# Altium project PCB_Project.PrjPcb
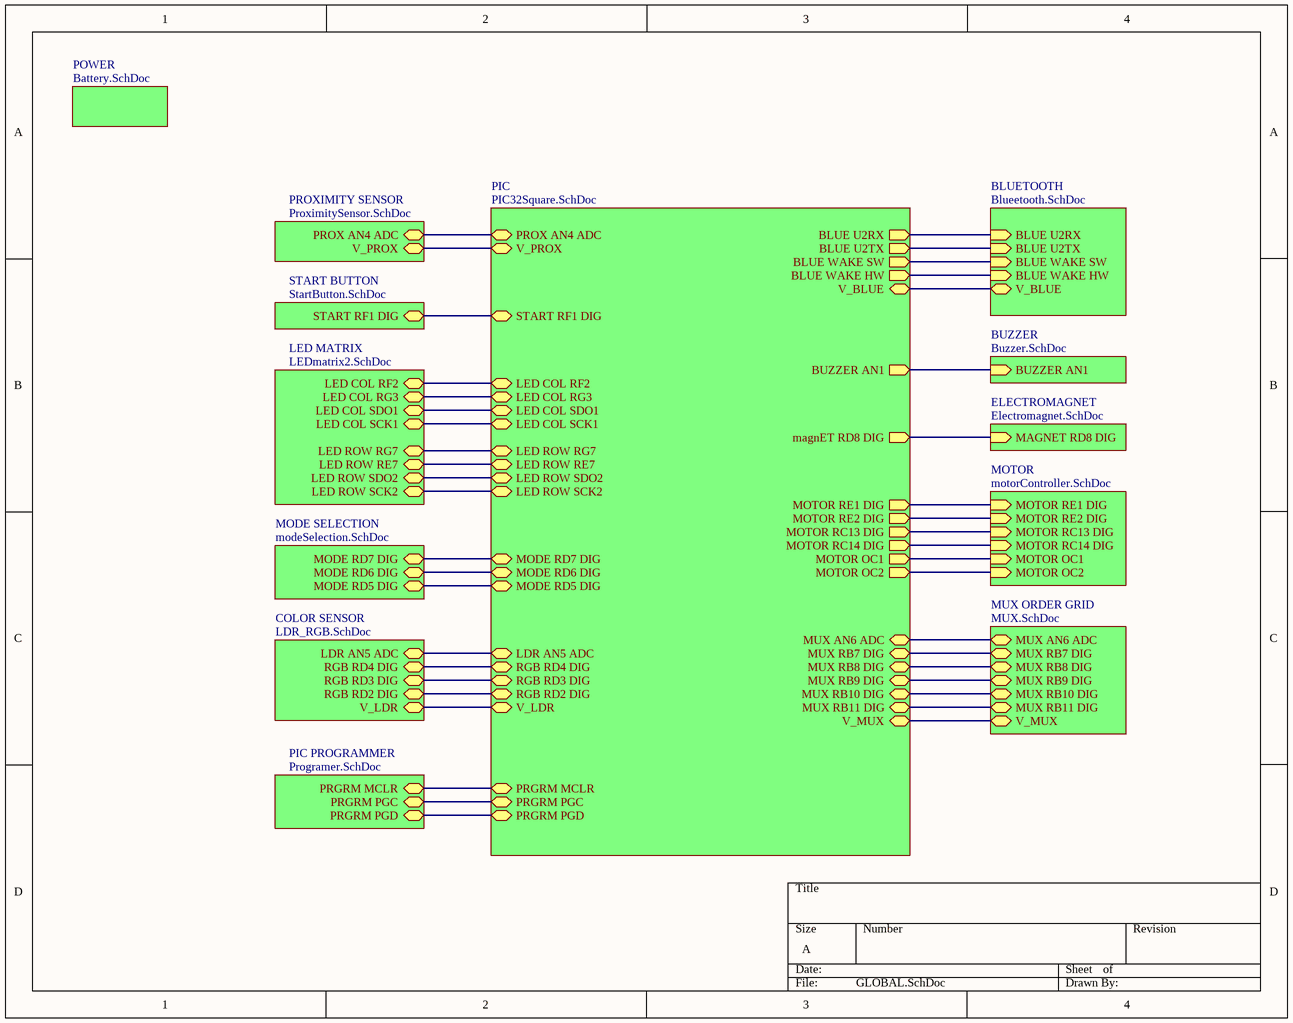
[diagram p0: GLOBAL.SchDoc]
14 sheets, 109 parts. Net scope: hierarchical (ports join the sheet entries above them; power ports are global).
Board file: PCB2.PcbDoc
Sheets:
  GLOBAL.SchDoc
    PIC = PIC32Square.SchDoc
    BLUETOOTH = Blueetooth.SchDoc
    BUZZER = Buzzer.SchDoc
    ELECTROMAGNET = Electromagnet.SchDoc
    MOTOR = motorController.SchDoc
    PROXIMITY SENSOR = ProximitySensor.SchDoc
    START BUTTON = StartButton.SchDoc
    LED MATRIX = LEDmatrix2.SchDoc
    MODE SELECTION = modeSelection.SchDoc
    COLOR SENSOR = LDR_RGB.SchDoc
    MUX ORDER GRID = MUX.SchDoc
    POWER = Battery.SchDoc
    PIC PROGRAMMER = Programer.SchDoc

## Sheet GLOBAL.SchDoc
size A

### Sub-sheets
BLUETOOTH = Blueetooth.SchDoc: BLUE U2RX (in), BLUE U2TX (in), BLUE WAKE SW (in), BLUE WAKE HW (in), V_BLUE
BUZZER = Buzzer.SchDoc: BUZZER AN1 (in)
COLOR SENSOR = LDR_RGB.SchDoc: LDR AN5 ADC, RGB RD4 DIG, RGB RD3 DIG, RGB RD2 DIG, V_LDR
ELECTROMAGNET = Electromagnet.SchDoc: MAGNET RD8 DIG (in)
LED MATRIX = LEDmatrix2.SchDoc: LED COL RF2, LED COL RG3, LED COL SDO1, LED COL SCK1, LED ROW RG7, LED ROW RE7, LED ROW SDO2, LED ROW SCK2
MODE SELECTION = modeSelection.SchDoc: MODE RD7 DIG, MODE RD6 DIG, MODE RD5 DIG
MOTOR = motorController.SchDoc: MOTOR RE1 DIG (in), MOTOR RE2 DIG (in), MOTOR RC13 DIG (in), MOTOR RC14 DIG (in), MOTOR OC1 (in), MOTOR OC2 (in)
MUX ORDER GRID = MUX.SchDoc: MUX AN6 ADC, MUX RB7 DIG, MUX RB8 DIG, MUX RB9 DIG, MUX RB10 DIG, MUX RB11 DIG, V_MUX
PIC = PIC32Square.SchDoc: BLUE U2RX (out), BLUE U2TX (out), BLUE WAKE SW (out), BLUE WAKE HW (out), BUZZER AN1 (out), magnET RD8 DIG (out), MOTOR RE1 DIG (out), MOTOR RE2 DIG (out), MOTOR RC13 DIG (out), MOTOR RC14 DIG (out), MOTOR OC1 (out), MOTOR OC2 (out), PROX AN4 ADC, START RF1 DIG, LED COL RF2, LED COL RG3, LED COL SDO1, LED COL SCK1, LED ROW RG7, LED ROW RE7, LED ROW SDO2, LED ROW SCK2, MODE RD7 DIG, MODE RD6 DIG, MODE RD5 DIG, LDR AN5 ADC, RGB RD4 DIG, RGB RD3 DIG, RGB RD2 DIG, MUX AN6 ADC, MUX RB7 DIG, MUX RB8 DIG, MUX RB9 DIG, MUX RB10 DIG, MUX RB11 DIG, V_BLUE, V_MUX, V_PROX, V_LDR, PRGRM MCLR, PRGRM PGD, PRGRM PGC
PIC PROGRAMMER = Programer.SchDoc: PRGRM MCLR, PRGRM PGC, PRGRM PGD
POWER = Battery.SchDoc: no entries
PROXIMITY SENSOR = ProximitySensor.SchDoc: PROX AN4 ADC, V_PROX
START BUTTON = StartButton.SchDoc: START RF1 DIG

### Nets
NetC3_2: sheet PIC/V_BLUE, sheet BLUETOOTH/V_BLUE
NetC5_1: sheet PIC/PRGRM MCLR, sheet PIC PROGRAMMER/PRGRM MCLR
NetP1_1: sheet PIC/V_LDR, sheet COLOR SENSOR/V_LDR
NetP1_2: sheet PIC/LDR AN5 ADC, sheet COLOR SENSOR/LDR AN5 ADC
NetPIC32Square_1: sheet PIC/magnET RD8 DIG, sheet ELECTROMAGNET/MAGNET RD8 DIG
NetPIC32Square_2: sheet PIC/RGB RD2 DIG, sheet COLOR SENSOR/RGB RD2 DIG
NetPIC32Square_3: sheet PIC/RGB RD3 DIG, sheet COLOR SENSOR/RGB RD3 DIG
NetPIC32Square_4: sheet PIC/RGB RD4 DIG, sheet COLOR SENSOR/RGB RD4 DIG
NetPIC32Square_6: sheet PIC/V_PROX, sheet PROXIMITY SENSOR/V_PROX
NetPIC32Square_12: sheet PIC/PROX AN4 ADC, sheet PROXIMITY SENSOR/PROX AN4 ADC
NetPIC32Square_13: sheet PIC/MUX AN6 ADC, sheet MUX ORDER GRID/MUX AN6 ADC
NetPIC32Square_15: sheet PIC/PRGRM PGC, sheet PIC PROGRAMMER/PRGRM PGC
NetPIC32Square_16: sheet PIC/PRGRM PGD, sheet PIC PROGRAMMER/PRGRM PGD
NetPIC32Square_17: sheet PIC/V_MUX, sheet MUX ORDER GRID/V_MUX
NetPIC32Square_18: sheet PIC/MUX RB11 DIG, sheet MUX ORDER GRID/MUX RB11 DIG
NetPIC32Square_21: sheet PIC/MUX RB10 DIG, sheet MUX ORDER GRID/MUX RB10 DIG
NetPIC32Square_22: sheet PIC/MUX RB9 DIG, sheet MUX ORDER GRID/MUX RB9 DIG
NetPIC32Square_23: sheet PIC/MUX RB8 DIG, sheet MUX ORDER GRID/MUX RB8 DIG
NetPIC32Square_24: sheet PIC/MUX RB7 DIG, sheet MUX ORDER GRID/MUX RB7 DIG
NetPIC32Square_27: sheet PIC/BUZZER AN1, sheet BUZZER/BUZZER AN1
NetPIC32Square_29: sheet PIC/BLUE WAKE HW, sheet BLUETOOTH/BLUE WAKE HW
NetPIC32Square_30: sheet PIC/BLUE WAKE SW, sheet BLUETOOTH/BLUE WAKE SW
NetPIC32Square_31: sheet PIC/BLUE U2RX, sheet BLUETOOTH/BLUE U2RX
NetPIC32Square_32: sheet PIC/BLUE U2TX, sheet BLUETOOTH/BLUE U2TX
NetPIC32Square_33: sheet PIC/MODE RD6 DIG, sheet MODE SELECTION/MODE RD6 DIG
NetPIC32Square_34: sheet PIC/MODE RD5 DIG, sheet MODE SELECTION/MODE RD5 DIG
NetPIC32Square_35: sheet PIC/MODE RD7 DIG, sheet MODE SELECTION/MODE RD7 DIG
NetPIC32Square_36: sheet PIC/START RF1 DIG, sheet START BUTTON/START RF1 DIG
NetPIC32Square_49: sheet PIC/MOTOR RC13 DIG, sheet MOTOR/MOTOR RC13 DIG
NetPIC32Square_50: sheet PIC/MOTOR OC2, sheet MOTOR/MOTOR OC2
NetPIC32Square_51: sheet PIC/MOTOR RC14 DIG, sheet MOTOR/MOTOR RC14 DIG
NetPIC32Square_52: sheet PIC/MOTOR OC1, sheet MOTOR/MOTOR OC1
NetPIC32Square_53: sheet PIC/MOTOR RE1 DIG, sheet MOTOR/MOTOR RE1 DIG
NetPIC32Square_54: sheet PIC/MOTOR RE2 DIG, sheet MOTOR/MOTOR RE2 DIG
NetPIC32Square_55: sheet PIC/LED ROW RE7, sheet LED MATRIX/LED ROW RE7
NetPIC32Square_58: sheet PIC/LED ROW SCK2, sheet LED MATRIX/LED ROW SCK2
NetPIC32Square_59: sheet PIC/LED COL RF2, sheet LED MATRIX/LED COL RF2
NetPIC32Square_60: sheet PIC/LED COL SDO1, sheet LED MATRIX/LED COL SDO1
NetPIC32Square_61: sheet PIC/LED ROW SDO2, sheet LED MATRIX/LED ROW SDO2
NetPIC32Square_62: sheet PIC/LED ROW RG7, sheet LED MATRIX/LED ROW RG7
NetPIC32Square_63: sheet PIC/LED COL RG3, sheet LED MATRIX/LED COL RG3
NetPIC32Square_64: sheet PIC/LED COL SCK1, sheet LED MATRIX/LED COL SCK1

## Sheet PIC32Square.SchDoc
size A
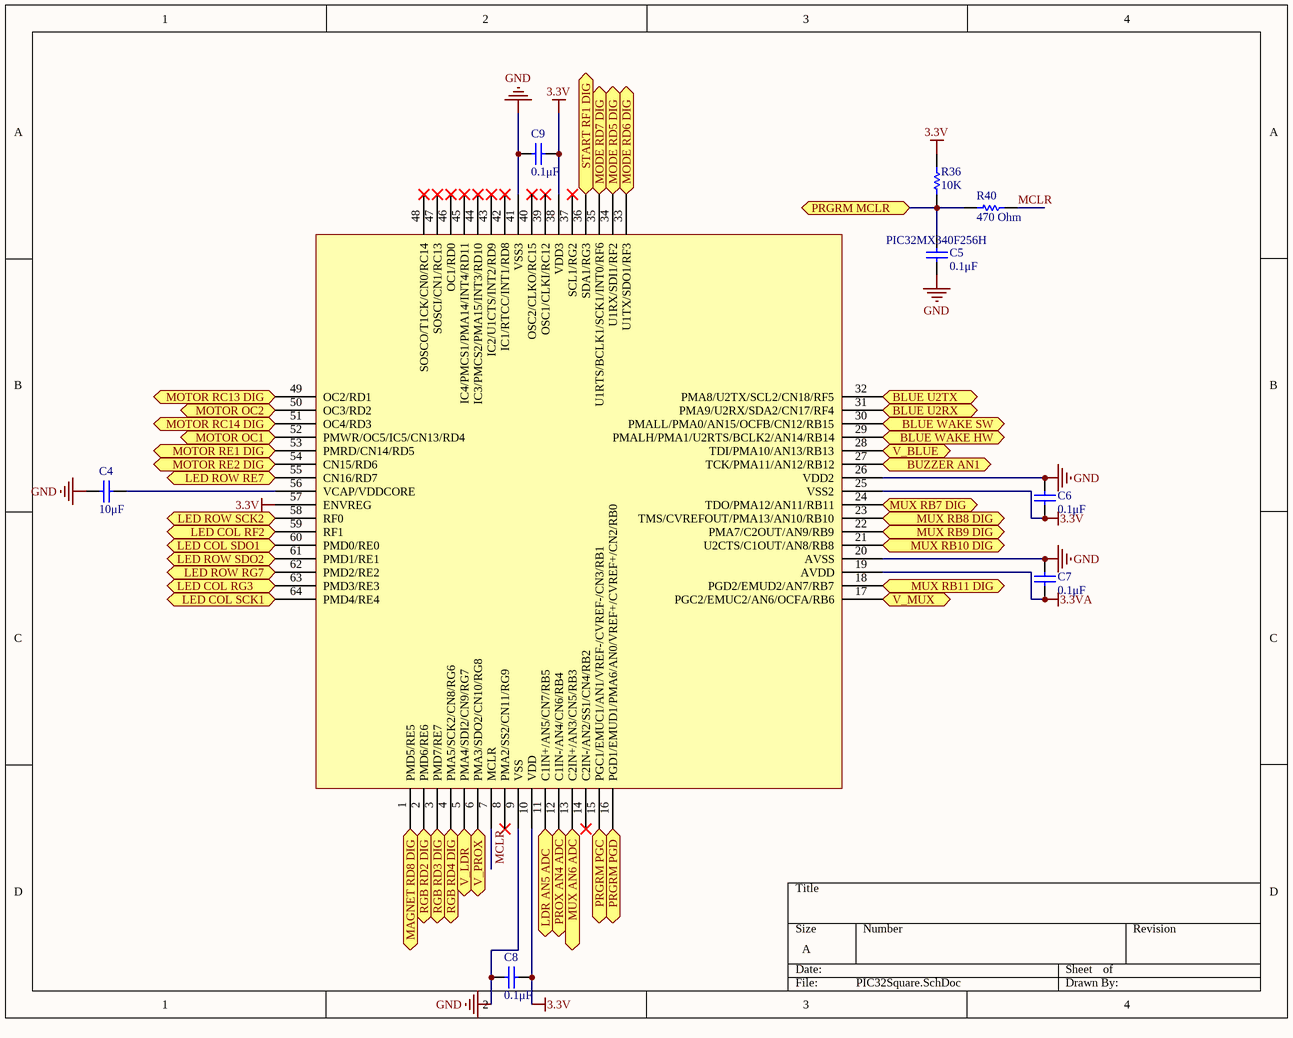
[diagram p1: PIC32Square.SchDoc]

### Parts
C4  10μF  [Capacitor]
C5  0.1μF  [Capacitor]
C6  0.1μF  [Capacitor]
C7  0.1μF  [Capacitor]
C8  0.1μF  [Capacitor]
C9  0.1μF  [Capacitor]
PIC32Square  PIC32MX340F256H  [PIC32]
R36  10K  [Resistor0603]
R40  470 Ohm  [Resistor0603]

### Ports
BLUE U2RX, BLUE U2TX, BLUE WAKE HW, BLUE WAKE SW, BUZZER AN1, LDR AN5 ADC, LED COL RF2, LED COL RG3, LED COL SCK1, LED COL SDO1, LED ROW RE7, LED ROW RG7, LED ROW SCK2, LED ROW SDO2, MAGNET RD8 DIG, MODE RD5 DIG, MODE RD6 DIG, MODE RD7 DIG, MOTOR OC1, MOTOR OC2, MOTOR RC13 DIG, MOTOR RC14 DIG, MOTOR RE1 DIG, MOTOR RE2 DIG, MUX AN6 ADC, MUX RB7 DIG, MUX RB8 DIG, MUX RB9 DIG, MUX RB10 DIG, MUX RB11 DIG, PRGRM MCLR, PRGRM PGC, PRGRM PGD, PROX AN4 ADC, RGB RD2 DIG, RGB RD3 DIG, RGB RD4 DIG, START RF1 DIG, V_BLUE, V_LDR, V_MUX, V_PROX

### Nets
3.3V: C6.1 C8.1 C9.2 PIC32Square.10(VDD) PIC32Square.25(VSS2) PIC32Square.38(VDD3) PIC32Square.57(ENVREG) R36.2
3.3VA: C7.1 PIC32Square.19(AVDD)
GND: C4.2 C5.2 C6.2 C7.2 C8.2 C9.1 PIC32Square.9(VSS) PIC32Square.20(AVSS) PIC32Square.26(VDD2) PIC32Square.41(VSS3)
MCLR: PIC32Square.7(MCLR) R40.1
NetC3_2: PIC32Square.28(TDI/PMA10/AN13/RB13) ; port V_BLUE
NetC4_1: C4.1 PIC32Square.56(VCAP/VDDCORE)
NetC5_1: C5.1 R36.1 R40.2 ; port PRGRM MCLR
NetP1_1: PIC32Square.5(PMA4/SDI2/CN9/RG7) ; port V_LDR
NetP1_2: PIC32Square.11(C1IN+/AN5/CN7/RB5) ; port LDR AN5 ADC
NetPIC32Square_1: PIC32Square.1(PMD5/RE5) ; port MAGNET RD8 DIG
NetPIC32Square_2: PIC32Square.2(PMD6/RE6) ; port RGB RD2 DIG
NetPIC32Square_3: PIC32Square.3(PMD7/RE7) ; port RGB RD3 DIG
NetPIC32Square_4: PIC32Square.4(PMA5/SCK2/CN8/RG6) ; port RGB RD4 DIG
NetPIC32Square_6: PIC32Square.6(PMA3/SDO2/CN10/RG8) ; port V_PROX
NetPIC32Square_12: PIC32Square.12(C1IN-/AN4/CN6/RB4) ; port PROX AN4 ADC
NetPIC32Square_13: PIC32Square.13(C2IN+/AN3/CN5/RB3) ; port MUX AN6 ADC
NetPIC32Square_15: PIC32Square.15(PGC1/EMUC1/AN1/VREF-/CVREF-/CN3/RB1) ; port PRGRM PGC
NetPIC32Square_16: PIC32Square.16(PGD1/EMUD1/PMA6/AN0/VREF+/CVREF+/CN2/RB0) ; port PRGRM PGD
NetPIC32Square_17: PIC32Square.17(PGC2/EMUC2/AN6/OCFA/RB6) ; port V_MUX
NetPIC32Square_18: PIC32Square.18(PGD2/EMUD2/AN7/RB7) ; port MUX RB11 DIG
NetPIC32Square_21: PIC32Square.21(U2CTS/C1OUT/AN8/RB8) ; port MUX RB10 DIG
NetPIC32Square_22: PIC32Square.22(PMA7/C2OUT/AN9/RB9) ; port MUX RB9 DIG
NetPIC32Square_23: PIC32Square.23(TMS/CVREFOUT/PMA13/AN10/RB10) ; port MUX RB8 DIG
NetPIC32Square_24: PIC32Square.24(TDO/PMA12/AN11/RB11) ; port MUX RB7 DIG
NetPIC32Square_27: PIC32Square.27(TCK/PMA11/AN12/RB12) ; port BUZZER AN1
NetPIC32Square_29: PIC32Square.29(PMALH/PMA1/U2RTS/BCLK2/AN14/RB14) ; port BLUE WAKE HW
NetPIC32Square_30: PIC32Square.30(PMALL/PMA0/AN15/OCFB/CN12/RB15) ; port BLUE WAKE SW
NetPIC32Square_31: PIC32Square.31(PMA9/U2RX/SDA2/CN17/RF4) ; port BLUE U2RX
NetPIC32Square_32: PIC32Square.32(PMA8/U2TX/SCL2/CN18/RF5) ; port BLUE U2TX
NetPIC32Square_33: PIC32Square.33(U1TX/SDO1/RF3) ; port MODE RD6 DIG
NetPIC32Square_34: PIC32Square.34(U1RX/SDI1/RF2) ; port MODE RD5 DIG
NetPIC32Square_35: PIC32Square.35(U1RTS/BCLK1/SCK1/INT0/RF6) ; port MODE RD7 DIG
NetPIC32Square_36: PIC32Square.36(SDA1/RG3) ; port START RF1 DIG
NetPIC32Square_49: PIC32Square.49(OC2/RD1) ; port MOTOR RC13 DIG
NetPIC32Square_50: PIC32Square.50(OC3/RD2) ; port MOTOR OC2
NetPIC32Square_51: PIC32Square.51(OC4/RD3) ; port MOTOR RC14 DIG
NetPIC32Square_52: PIC32Square.52(PMWR/OC5/IC5/CN13/RD4) ; port MOTOR OC1
NetPIC32Square_53: PIC32Square.53(PMRD/CN14/RD5) ; port MOTOR RE1 DIG
NetPIC32Square_54: PIC32Square.54(CN15/RD6) ; port MOTOR RE2 DIG
NetPIC32Square_55: PIC32Square.55(CN16/RD7) ; port LED ROW RE7
NetPIC32Square_58: PIC32Square.58(RF0) ; port LED ROW SCK2
NetPIC32Square_59: PIC32Square.59(RF1) ; port LED COL RF2
NetPIC32Square_60: PIC32Square.60(PMD0/RE0) ; port LED COL SDO1
NetPIC32Square_61: PIC32Square.61(PMD1/RE1) ; port LED ROW SDO2
NetPIC32Square_62: PIC32Square.62(PMD2/RE2) ; port LED ROW RG7
NetPIC32Square_63: PIC32Square.63(PMD3/RE3) ; port LED COL RG3
NetPIC32Square_64: PIC32Square.64(PMD4/RE4) ; port LED COL SCK1

Not connected (* = marked no-connect by the designer): PIC32Square 8(PMA2/SS2/CN11/RG9)* 14(C2IN-/AN2/SS1/CN4/RB2)* 37(SCL1/RG2)* 39(OSC1/CLKI/RC12)* 40(OSC2/CLKO/RC15)* 42(IC1/RTCC/INT1/RD8)* 43(IC2/U1CTS/INT2/RD9)* 44(IC3/PMCS2/PMA15/INT3/RD10)* 45(IC4/PMCS1/PMA14/INT4/RD11)* 46(OC1/RD0)* 47(SOSCI/CN1/RC13)* 48(SOSCO/T1CK/CN0/RC14)*

### Library data of the parts
C4-C9 = Cap: Capacitor; Published: 8-Jun-2000; LatestRevisionDate: 17-Jul-2002; LatestRevisionNote: Re-released for DXP Platform.; PackageReference: RAD-0.3; Publisher: Altium Limited; PackageDescription: Radial Cap, Thru-Hole; 2 Leads; 0.3 in Pin Spacing
  C4: Value: 10μF
  C5-C9: Value: 0.1μF
PIC32Square = PIC32square: Farnell Reference: 1523322
R36 R40 = Res1: Resistor; Published: 8-Jun-2000; LatestRevisionDate: 17-Jul-2002; LatestRevisionNote: Re-released for DXP Platform.; PackageReference: AXIAL-0.3; Publisher: Altium Limited; PackageDescription: Axial Device, Thru-Hole; 2 Leads; 0.3 in Pin Spacing
  R36: Value: 10K
  R40: Value: 470 Ohm

## Sheet Blueetooth.SchDoc
size A
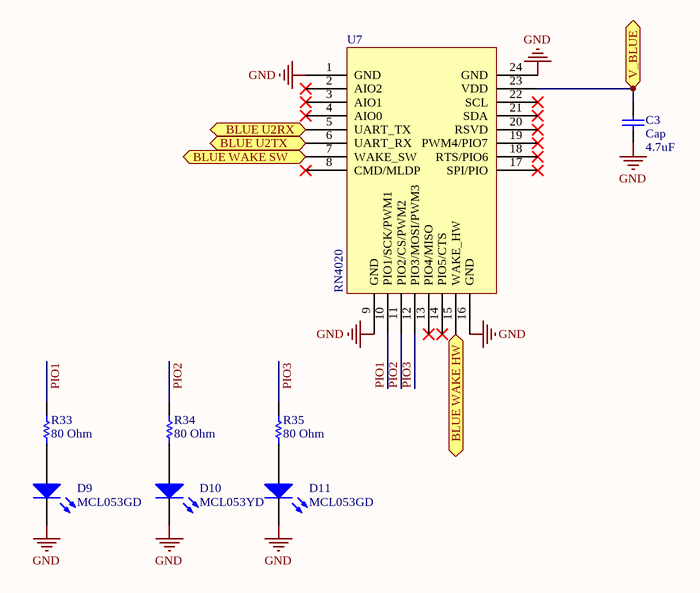
[diagram p2: Blueetooth.SchDoc]

### Parts
C3  Cap  value 4.7uF  [Capacitor]
D9  MCL053GD  [LedGreen]
D10  MCL053YD  [LedGreen]
D11  MCL053GD  [LedGreen]
R33  80 Ohm  [Resistor0603]
R34  80 Ohm  [Resistor0603]
R35  80 Ohm  [Resistor0603]
U7  RN4020  [bluetooth]

### Ports
BLUE U2RX, BLUE U2TX, BLUE WAKE HW, BLUE WAKE SW, V_BLUE

### Nets
GND: C3.1 D9.2(K) D10.2(K) D11.2(K) U7.1(GND) U7.9(GND) U7.16(GND) U7.24(GND)
PIO1: R33.2 U7.10(PIO1/SCK/PWM1)
PIO2: R34.2 U7.11(PIO2/CS/PWM2)
PIO3: R35.2 U7.12(PIO3/MOSI/PWM3)
NetC3_2: C3.2 U7.23(VDD) ; port V_BLUE
NetD9_1: D9.1(A) R33.1
NetD10_1: D10.1(A) R34.1
NetD11_1: D11.1(A) R35.1
NetPIC32Square_29: U7.15(WAKE_HW) ; port BLUE WAKE HW
NetPIC32Square_30: U7.7(WAKE_SW) ; port BLUE WAKE SW
NetPIC32Square_31: U7.5(UART_TX) ; port BLUE U2RX
NetPIC32Square_32: U7.6(UART_RX) ; port BLUE U2TX

Not connected (* = marked no-connect by the designer): U7 2(AIO2)* 3(AIO1)* 4(AIO0)* 8(CMD/MLDP)* 13(PIO4/MISO)* 14(PIO5/CTS)* 17(SPI/PIO)* 18(RTS/PIO6)* 19(PWM4/PIO7)* 20(RSVD)* 21(SDA)* 22(SCL)*

### Library data of the parts
C3 = Cap: Capacitor; Published: 8-Jun-2000; LatestRevisionDate: 17-Jul-2002; LatestRevisionNote: Re-released for DXP Platform.; PackageReference: RAD-0.3; Publisher: Altium Limited; PackageDescription: Radial Cap, Thru-Hole; 2 Leads; 0.3 in Pin Spacing
D9-D11 = LED0: Typical INFRARED GaAs LED; Published: 8-Jun-2000; LatestRevisionDate: 08-Jul-2005; LatestRevisionNote: Mech Layer 1 removed.; PackageReference: LED-0; Publisher: Altium Limited; PackageDescription: LED; 2 Leads
  D9 D11: Farnell Reference: 1581138
  D10: Farnell Reference: 1581139
R33-R35 = Res1: Resistor; Published: 8-Jun-2000; LatestRevisionDate: 17-Jul-2002; LatestRevisionNote: Re-released for DXP Platform.; PackageReference: AXIAL-0.3; Publisher: Altium Limited; PackageDescription: Axial Device, Thru-Hole; 2 Leads; 0.3 in Pin Spacing; Value: 80 Ohm
U7 = Blueetooth: Farnell Reference: 2442930

## Sheet Buzzer.SchDoc
size A
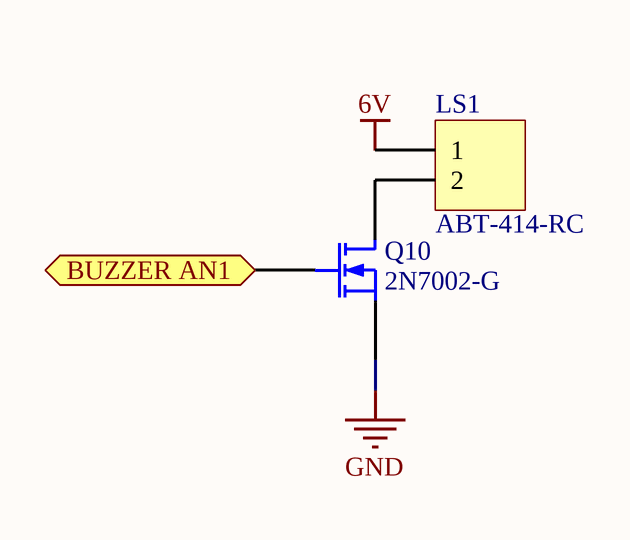
[diagram p3: Buzzer.SchDoc]

### Parts
LS1  ABT-414-RC  [Buzzer]
Q10  2N7002-G  [Mosfet]

### Ports
BUZZER AN1

### Nets
6V: LS1.1
GND: Q10.2(S)
NetLS1_2: LS1.2 Q10.3(D)
NetPIC32Square_27: Q10.1(G) ; port BUZZER AN1

### Library data of the parts
LS1 = Header 2: Header, 2-Pin; LatestRevisionDate: 17-Jul-2002; LatestRevisionNote: Re-released for DXP Platform.; Publisher: Altium Limited
Q10 = MOSFET-N: N-Channel MOSFET; Published: 8-Jun-2000; LatestRevisionDate: 17-Jul-2002; LatestRevisionNote: Re-released for DXP Platform.; PackageVersion: 1995/1996; PackageReference: E3; Publisher: Altium Limited; PackageDescription: TO, Flat Index; 3 In-Line, Axial Leads; Body Dia. 4.6mm; Lead Dia. 0.5 mm (max); Farnell Reference: 2775064

## Sheet Electromagnet.SchDoc
size A
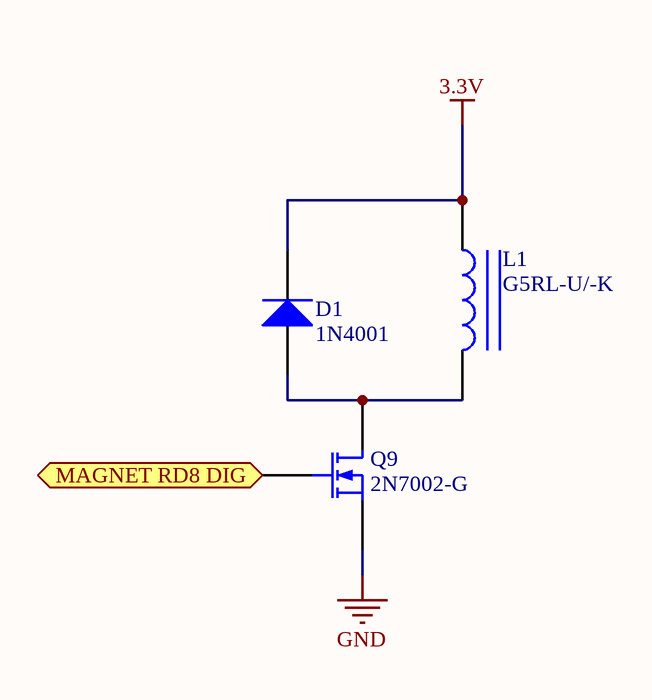
[diagram p4: Electromagnet.SchDoc]

### Parts
D1  1N4001  [Diode]
L1  G5RL-U/-K  [Electromagnet]
Q9  2N7002-G  [Mosfet]

### Ports
MAGNET RD8 DIG

### Nets
3.3V: D1.2(K) L1.1
GND: Q9.2(S)
NetD1_1: D1.1(A) L1.2 Q9.3(D)
NetPIC32Square_1: Q9.1(G) ; port MAGNET RD8 DIG

### Library data of the parts
D1 = Diode: Default Diode; Published: 8-Jun-2000; LatestRevisionDate: 17-Jul-2002; LatestRevisionNote: Re-released for DXP Platform.; PackageVersion: Sep-1996; PackageReference: SMC; Publisher: Altium Limited; PackageDescription: DO-214-AB/SMC; 2 C-Bend Leads; Body 7.9 x 5.9 mm, inc. leads (LxW); Code_JEDEC: DO-214-AB; Farnell Reference: 9564993
L1 = Inductor Iron: Magnetic-Core Inductor; Value: 10mH; Published: 24-Mar-1999; LatestRevisionDate: 17-Jul-2002; LatestRevisionNote: Re-released for DXP Platform.; PackageReference: AXIAL-0.9; Publisher: Altium Limited; PackageDescription: Axial Device, Thru-Hole; 2 Leads; 0.9 in Pin Spacing; Farnell Reference: 2432865
Q9 = MOSFET-N: N-Channel MOSFET; Published: 8-Jun-2000; LatestRevisionDate: 17-Jul-2002; LatestRevisionNote: Re-released for DXP Platform.; PackageVersion: 1995/1996; PackageReference: E3; Publisher: Altium Limited; PackageDescription: TO, Flat Index; 3 In-Line, Axial Leads; Body Dia. 4.6mm; Lead Dia. 0.5 mm (max); Farnell Reference: 2775064

## Sheet motorController.SchDoc
size A
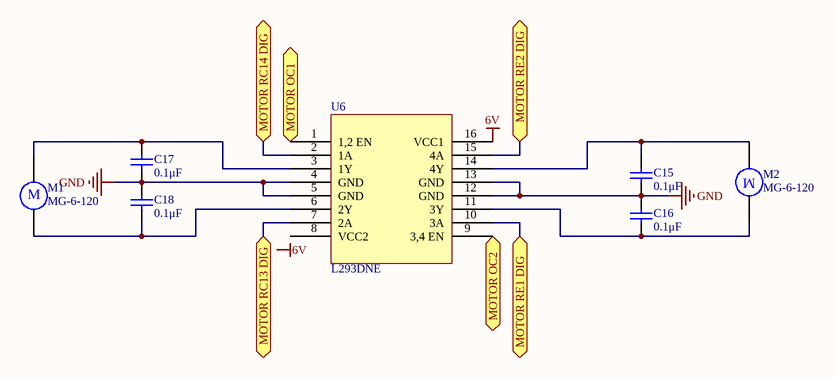
[diagram p5: motorController.SchDoc]

### Parts
C15  0.1μF  [capacitor]
C16  0.1μF  [capacitor]
C17  0.1μF  [capacitor]
C18  0.1μF  [capacitor]
M1  MG-6-120  [Motor2]
M2  MG-6-120  [Motor2]
U6  L293DNE  [MotorDriver]

### Ports
MOTOR OC1, MOTOR OC2, MOTOR RC13 DIG, MOTOR RC14 DIG, MOTOR RE1 DIG, MOTOR RE2 DIG

### Nets
6V: U6.16(VCC1)
GND: C15.2 C16.1 C17.1 C18.2 U6.4(GND) U6.5(GND) U6.12(GND) U6.13(GND)
NetC15_1: C15.1 M2.2 U6.14(4Y)
NetC16_2: C16.2 M2.1 U6.11(3Y)
NetC17_2: C17.2 M1.1 U6.3(1Y)
NetC18_1: C18.1 M1.2 U6.6(2Y)
NetPIC32Square_49: U6.7(2A) ; port MOTOR RC13 DIG
NetPIC32Square_50: U6.9(3,4_EN) ; port MOTOR OC2
NetPIC32Square_51: U6.2(1A) ; port MOTOR RC14 DIG
NetPIC32Square_52: U6.1(1,2_EN) ; port MOTOR OC1
NetPIC32Square_53: U6.10(3A) ; port MOTOR RE1 DIG
NetPIC32Square_54: U6.15(4A) ; port MOTOR RE2 DIG

Not connected (* = marked no-connect by the designer): U6 8(VCC2)

### Notes on the sheet
- Labels drawn without touching a wire or pin: 6V
- (in symbol Motor) M

### Library data of the parts
C15-C18 = Cap: Capacitor; Published: 8-Jun-2000; LatestRevisionDate: 17-Jul-2002; LatestRevisionNote: Re-released for DXP Platform.; PackageReference: RAD-0.3; Publisher: Altium Limited; PackageDescription: Radial Cap, Thru-Hole; 2 Leads; 0.3 in Pin Spacing; Value: 0.1μF
M1 M2 = Motor: Motor, General Kind; Published: 24-Mar-1999; LatestRevisionDate: 17-Jul-2002; LatestRevisionNote: Re-released for DXP Platform.; PackageReference: RB5-10.5; Publisher: Altium Limited; PackageDescription: Capacitor (Radial); 2 Leads; Olimex Reference: MG-6-120
U6 = Motor Driver: Farnell Reference: 1470423

## Sheet ProximitySensor.SchDoc
size A
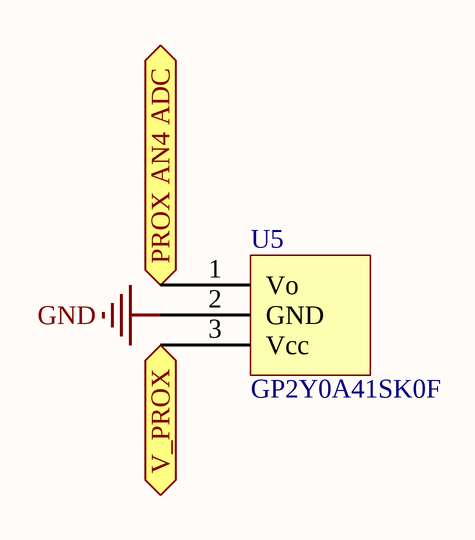
[diagram p6: ProximitySensor.SchDoc]

### Parts
U5  GP2Y0A41SK0F  [Proximity2]

### Ports
PROX AN4 ADC, V_PROX

### Nets
GND: U5.2(GND)
NetPIC32Square_6: U5.3(Vcc) ; port V_PROX
NetPIC32Square_12: U5.1(Vo) ; port PROX AN4 ADC

### Library data of the parts
U5 = Proximity sensor: Farnell Reference: 1618431

## Sheet StartButton.SchDoc
size A
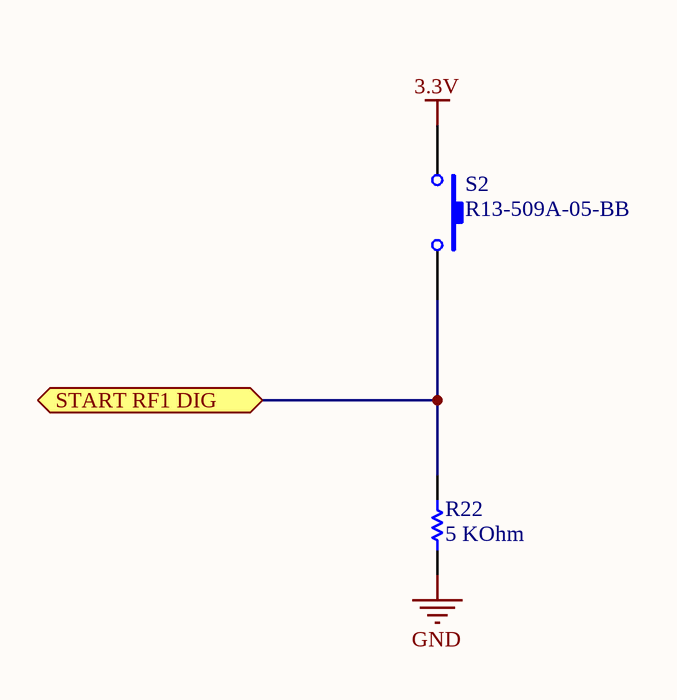
[diagram p7: StartButton.SchDoc]

### Parts
R22  5 KOhm  [Resistor0603]
S2  R13-509A-05-BB  [StartButton]

### Ports
START RF1 DIG

### Nets
3.3V: S2.1
GND: R22.1
NetPIC32Square_36: R22.2 S2.2 ; port START RF1 DIG

### Library data of the parts
R22 = Res1: Resistor; Published: 8-Jun-2000; LatestRevisionDate: 17-Jul-2002; LatestRevisionNote: Re-released for DXP Platform.; PackageReference: AXIAL-0.3; Publisher: Altium Limited; PackageDescription: Axial Device, Thru-Hole; 2 Leads; 0.3 in Pin Spacing; Value: 5 KOhm
S2 = SW-PB: Switch; Published: 24-Mar-1999; LatestRevisionDate: 17-Jul-2002; LatestRevisionNote: Re-released for DXP Platform.; PackageReference: SPST-2; Publisher: Altium Limited; PackageDescription: Switch; 2 Leads; Farnell Reference: 1634682

## Sheet LEDmatrix2.SchDoc
size A
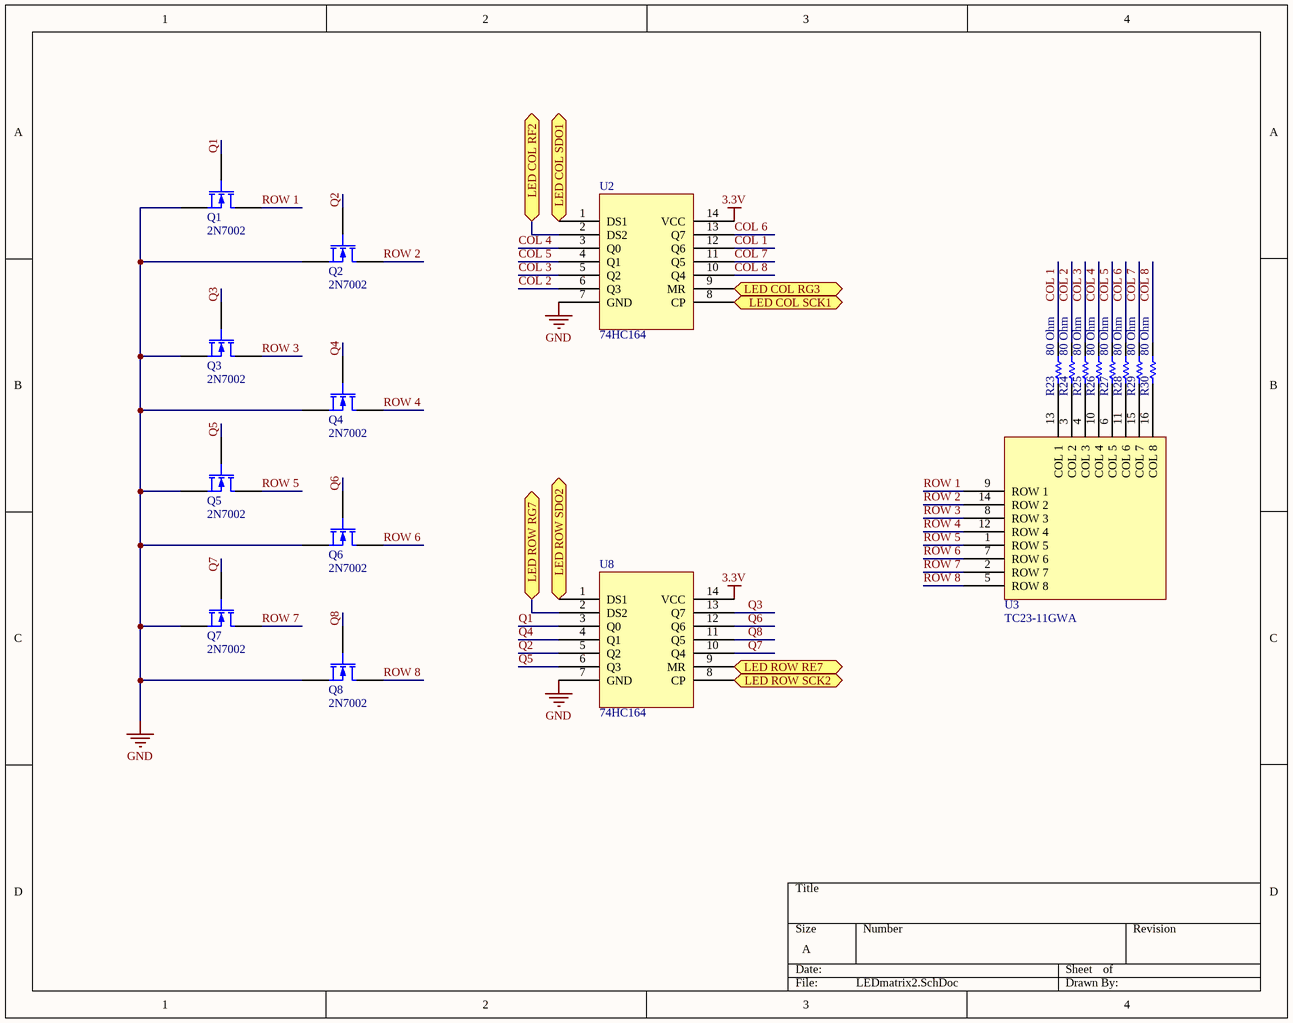
[diagram p8: LEDmatrix2.SchDoc]

### Parts
Q1  2N7002  [Mosfet]
Q2  2N7002  [Mosfet]
Q3  2N7002  [Mosfet]
Q4  2N7002  [Mosfet]
Q5  2N7002  [Mosfet]
Q6  2N7002  [Mosfet]
Q7  2N7002  [Mosfet]
Q8  2N7002  [Mosfet]
R23  80 Ohm  [Resistor0603]
R24  80 Ohm  [Resistor0603]
R25  80 Ohm  [Resistor0603]
R26  80 Ohm  [Resistor0603]
R27  80 Ohm  [Resistor0603]
R28  80 Ohm  [Resistor0603]
R29  80 Ohm  [Resistor0603]
R30  80 Ohm  [Resistor0603]
U2  74HC164  [SHIFT REGISTER]
U3  TC23-11GWA  [LEDPANEL]
U8  74HC164  [SHIFT REGISTER]

### Ports
LED COL RF2, LED COL RG3, LED COL SCK1, LED COL SDO1, LED ROW RE7, LED ROW RG7, LED ROW SCK2, LED ROW SDO2

### Nets
3.3V: U2.14(VCC) U8.14(VCC)
GND: Q1.3(S) Q2.3(S) Q3.3(S) Q4.3(S) Q5.3(S) Q6.3(S) Q7.3(S) Q8.3(S) U2.7(GND) U8.7(GND)
COL 1: R23.2 U2.12(Q6)
COL 2: R24.2 U2.6(Q3)
COL 3: R25.2 U2.5(Q2)
COL 4: R26.2 U2.3(Q0)
COL 5: R27.2 U2.4(Q1)
COL 6: R28.2 U2.13(Q7)
COL 7: R29.2 U2.11(Q5)
COL 8: R30.2 U2.10(Q4)
Q1: Q1.2(G) U8.3(Q0)
Q2: Q2.2(G) U8.5(Q2)
Q3: Q3.2(G) U8.13(Q7)
Q4: Q4.2(G) U8.4(Q1)
Q5: Q5.2(G) U8.6(Q3)
Q6: Q6.2(G) U8.12(Q6)
Q7: Q7.2(G) U8.10(Q4)
Q8: Q8.2(G) U8.11(Q5)
ROW 1: Q1.1(D) U3.9(ROW_1)
ROW 2: Q2.1(D) U3.14(ROW_2)
ROW 3: Q3.1(D) U3.8(ROW_3)
ROW 4: Q4.1(D) U3.12(ROW_4)
ROW 5: Q5.1(D) U3.1(ROW_5)
ROW 6: Q6.1(D) U3.7(ROW_6)
ROW 7: Q7.1(D) U3.2(ROW_7)
ROW 8: Q8.1(D) U3.5(ROW_8)
NetPIC32Square_55: U8.9(MR) ; port LED ROW RE7
NetPIC32Square_58: U8.8(CP) ; port LED ROW SCK2
NetPIC32Square_59: U2.2(DS2) ; port LED COL RF2
NetPIC32Square_60: U2.1(DS1) ; port LED COL SDO1
NetPIC32Square_61: U8.1(DS1) ; port LED ROW SDO2
NetPIC32Square_62: U8.2(DS2) ; port LED ROW RG7
NetPIC32Square_63: U2.9(MR) ; port LED COL RG3
NetPIC32Square_64: U2.8(CP) ; port LED COL SCK1
NetR23_1: R23.1 U3.13(COL_1)
NetR24_1: R24.1 U3.3(COL_2)
NetR25_1: R25.1 U3.4(COL_3)
NetR26_1: R26.1 U3.10(COL_4)
NetR27_1: R27.1 U3.6(COL_5)
NetR28_1: R28.1 U3.11(COL_6)
NetR29_1: R29.1 U3.15(COL_7)
NetR30_1: R30.1 U3.16(COL_8)

### Library data of the parts
Q1-Q8 = MOSFET-N: N-Channel MOSFET; Published: 8-Jun-2000; LatestRevisionDate: 17-Jul-2002; LatestRevisionNote: Re-released for DXP Platform.; PackageVersion: 1995/1996; PackageReference: E3; Publisher: Altium Limited; PackageDescription: TO, Flat Index; 3 In-Line, Axial Leads; Body Dia. 4.6mm; Lead Dia. 0.5 mm (max); Farnell Reference: 2775064
R23-R30 = Res1: Resistor; Published: 8-Jun-2000; LatestRevisionDate: 17-Jul-2002; LatestRevisionNote: Re-released for DXP Platform.; PackageReference: AXIAL-0.3; Publisher: Altium Limited; PackageDescription: Axial Device, Thru-Hole; 2 Leads; 0.3 in Pin Spacing; Value: 80 Ohm
U2 U8 = Shift Register: Farnell Reference: 1103161
U3 = LED Dot Matrix: Farnell Reference: 2290396

## Sheet modeSelection.SchDoc
size A
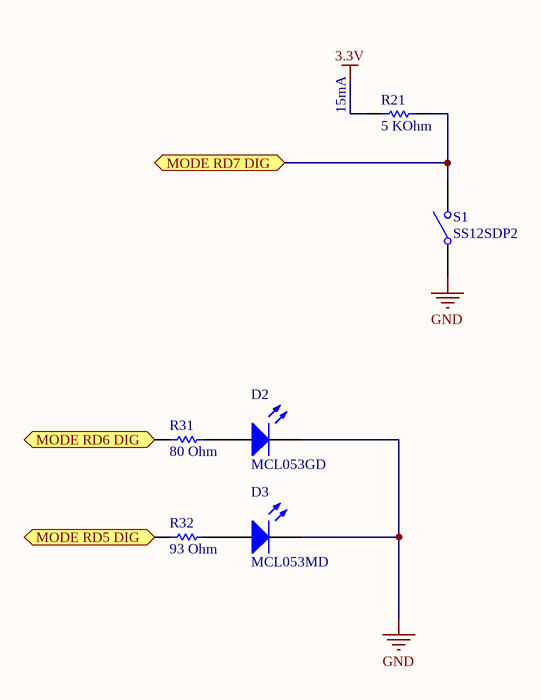
[diagram p9: modeSelection.SchDoc]

### Parts
D2  MCL053GD  [LedGreen]
D3  MCL053MD  [LedGreen]
R21  5 KOhm  [Resistor0603]
R31  80 Ohm  [Resistor0603]
R32  93 Ohm  [Resistor0603]
S1  SS12SDP2  [Switch]

### Ports
MODE RD5 DIG, MODE RD6 DIG, MODE RD7 DIG

### Nets
3.3V: R21.2
GND: D2.2(K) D3.2(K) S1.1(COMMON)
NetD2_1: D2.1(A) R31.2
NetD3_1: D3.1(A) R32.2
NetPIC32Square_33: R31.1 ; port MODE RD6 DIG
NetPIC32Square_34: R32.1 ; port MODE RD5 DIG
NetPIC32Square_35: R21.1 S1.2(NO) ; port MODE RD7 DIG

### Notes on the sheet
- (near R21) 15mA

### Library data of the parts
D2 D3 = LED0: Typical INFRARED GaAs LED; Published: 8-Jun-2000; LatestRevisionDate: 08-Jul-2005; LatestRevisionNote: Mech Layer 1 removed.; PackageReference: LED-0; Publisher: Altium Limited; PackageDescription: LED; 2 Leads
  D2: Farnell Reference: 1581138
  D3: Farnell Reference: 1581137
R21 R31 R32 = Res1: Resistor; Published: 8-Jun-2000; LatestRevisionDate: 17-Jul-2002; LatestRevisionNote: Re-released for DXP Platform.; PackageReference: AXIAL-0.3; Publisher: Altium Limited; PackageDescription: Axial Device, Thru-Hole; 2 Leads; 0.3 in Pin Spacing
  R21: Value: 5 KOhm
  R31: Value: 80 Ohm
  R32: Value: 93 Ohm
S1 = SW-SPST: Single-Pole, Single-Throw Switch; Published: 24-Mar-1999; LatestRevisionDate: 17-Jul-2002; LatestRevisionNote: Re-released for DXP Platform.; PackageReference: SPST-2; Publisher: Altium Limited; PackageDescription: Switch; 2 Leads; Farnell Reference: 1524325

## Sheet LDR_RGB.SchDoc
size A
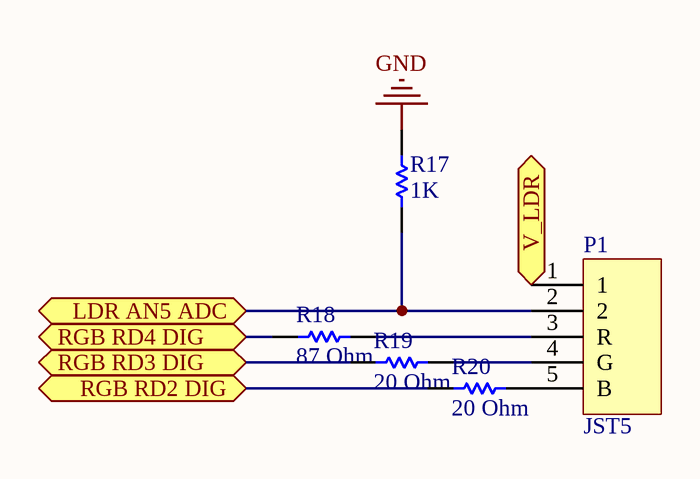
[diagram p10: LDR_RGB.SchDoc]

### Parts
P1  JST5  [LDR_RGB]
R17  1K  [Resistor0603]
R18  87 Ohm  [Resistor0603]
R19  20 Ohm  [Resistor0603]
R20  20 Ohm  [Resistor0603]

### Ports
LDR AN5 ADC, RGB RD2 DIG, RGB RD3 DIG, RGB RD4 DIG, V_LDR

### Nets
GND: R17.2
NetP1_1: P1.1 ; port V_LDR
NetP1_2: P1.2 R17.1 ; port LDR AN5 ADC
NetP1_3: P1.3(R) R18.2
NetP1_4: P1.4(G) R19.2
NetP1_5: P1.5(B) R20.2
NetPIC32Square_2: R20.1 ; port RGB RD2 DIG
NetPIC32Square_3: R19.1 ; port RGB RD3 DIG
NetPIC32Square_4: R18.1 ; port RGB RD4 DIG

### Library data of the parts
P1 = MHDR1X5: Header, 5-Pin; LatestRevisionDate: 17-Jul-2002; LatestRevisionNote: Re-released for DXP Platform.; Publisher: Altium Limited
R17-R20 = Res1: Resistor; Published: 8-Jun-2000; LatestRevisionDate: 17-Jul-2002; LatestRevisionNote: Re-released for DXP Platform.; PackageReference: AXIAL-0.3; Publisher: Altium Limited; PackageDescription: Axial Device, Thru-Hole; 2 Leads; 0.3 in Pin Spacing
  R17: Value: 1K
  R18: Value: 87 Ohm
  R19 R20: Value: 20 Ohm

## Sheet MUX.SchDoc
size A
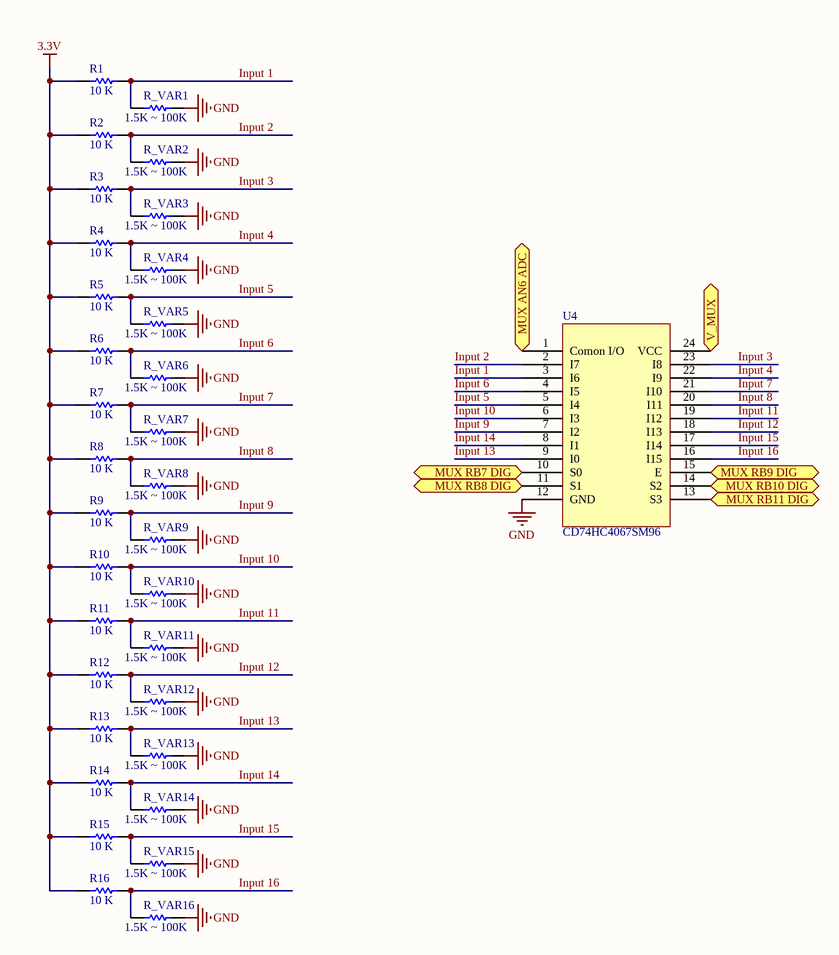
[diagram p11: MUX.SchDoc]

### Parts
R1  10 K  [Resistor0603]
R2  10 K  [Resistor0603]
R3  10 K  [Resistor0603]
R4  10 K  [Resistor0603]
R5  10 K  [Resistor0603]
R6  10 K  [Resistor0603]
R7  10 K  [Resistor0603]
R8  10 K  [Resistor0603]
R9  10 K  [Resistor0603]
R10  10 K  [Resistor0603]
R11  10 K  [Resistor0603]
R12  10 K  [Resistor0603]
R13  10 K  [Resistor0603]
R14  10 K  [Resistor0603]
R15  10 K  [Resistor0603]
R16  10 K  [Resistor0603]
R_VAR1  1.5K ~ 100K  [OrderPiece]
R_VAR2  1.5K ~ 100K  [OrderPiece]
R_VAR3  1.5K ~ 100K  [OrderPiece]
R_VAR4  1.5K ~ 100K  [OrderPiece]
R_VAR5  1.5K ~ 100K  [OrderPiece]
R_VAR6  1.5K ~ 100K  [OrderPiece]
R_VAR7  1.5K ~ 100K  [OrderPiece]
R_VAR8  1.5K ~ 100K  [OrderPiece]
R_VAR9  1.5K ~ 100K  [OrderPiece]
R_VAR10  1.5K ~ 100K  [OrderPiece]
R_VAR11  1.5K ~ 100K  [OrderPiece]
R_VAR12  1.5K ~ 100K  [OrderPiece]
R_VAR13  1.5K ~ 100K  [OrderPiece]
R_VAR14  1.5K ~ 100K  [OrderPiece]
R_VAR15  1.5K ~ 100K  [OrderPiece]
R_VAR16  1.5K ~ 100K  [OrderPiece]
U4  CD74HC4067SM96  [MUX]

### Ports
MUX AN6 ADC, MUX RB7 DIG, MUX RB8 DIG, MUX RB9 DIG, MUX RB10 DIG, MUX RB11 DIG, V_MUX

### Nets
3.3V: R1.1 R2.1 R3.1 R4.1 R5.1 R6.1 R7.1 R8.1 R9.1 R10.1 R11.1 R12.1 R13.1 R14.1 R15.1 R16.1
GND: R_VAR1.2 R_VAR2.2 R_VAR3.2 R_VAR4.2 R_VAR5.2 R_VAR6.2 R_VAR7.2 R_VAR8.2 R_VAR9.2 R_VAR10.2 R_VAR11.2 R_VAR12.2 R_VAR13.2 R_VAR14.2 R_VAR15.2 R_VAR16.2 U4.12(GND)
Input 1: R1.2 R_VAR1.1 U4.3(I6)
Input 2: R2.2 R_VAR2.1 U4.2(I7)
Input 3: R3.2 R_VAR3.1 U4.23(I8)
Input 4: R4.2 R_VAR4.1 U4.22(I9)
Input 5: R5.2 R_VAR5.1 U4.5(I4)
Input 6: R6.2 R_VAR6.1 U4.4(I5)
Input 7: R7.2 R_VAR7.1 U4.21(I10)
Input 8: R8.2 R_VAR8.1 U4.20(I11)
Input 9: R9.2 R_VAR9.1 U4.7(I2)
Input 10: R10.2 R_VAR10.1 U4.6(I3)
Input 11: R11.2 R_VAR11.1 U4.19(I12)
Input 12: R12.2 R_VAR12.1 U4.18(I13)
Input 13: R13.2 R_VAR13.1 U4.9(I0)
Input 14: R14.2 R_VAR14.1 U4.8(I1)
Input 15: R15.2 R_VAR15.1 U4.17(I14)
Input 16: R16.2 R_VAR16.1 U4.16(I15)
NetPIC32Square_13: U4.1(Comon_I/O) ; port MUX AN6 ADC
NetPIC32Square_17: U4.24(VCC) ; port V_MUX
NetPIC32Square_18: U4.13(S3) ; port MUX RB11 DIG
NetPIC32Square_21: U4.14(S2) ; port MUX RB10 DIG
NetPIC32Square_22: U4.15(E) ; port MUX RB9 DIG
NetPIC32Square_23: U4.11(S1) ; port MUX RB8 DIG
NetPIC32Square_24: U4.10(S0) ; port MUX RB7 DIG

### Library data of the parts
R1-R16 R_VAR1-R_VAR16 = Res1: Resistor; Published: 8-Jun-2000; LatestRevisionDate: 17-Jul-2002; LatestRevisionNote: Re-released for DXP Platform.; PackageReference: AXIAL-0.3; Publisher: Altium Limited; PackageDescription: Axial Device, Thru-Hole; 2 Leads; 0.3 in Pin Spacing
  R1-R16: Value: 10 K
  R_VAR1-R_VAR16: Value: 1.5K ~ 100K
U4 = Analog Multiplexor: Farnell Reference: 1601157

## Sheet Battery.SchDoc
size A
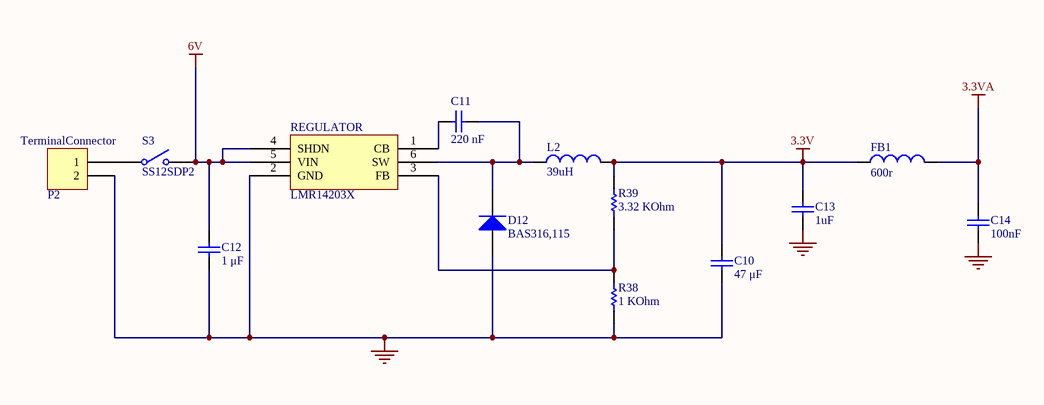
[diagram p12: Battery.SchDoc]

### Parts
C10  47 μF  [Capacitor]
C11  220 nF  [Capacitor]
C12  1 μF  [Capacitor]
C13  1uF  [Capacitor]
C14  100nF  [Capacitor]
D12  BAS316,115  [Didode (Regulator)]
FB1  value 600r  [Inductor]  (hidden comment: Comment)
L2  39uH  [Inductor (regulator)]
P2  TerminalConnector  [TerminalConector]
R38  1 KOhm  [Resistor0603]
R39  3.32 KOhm  [Resistor0603]
REGULATOR  LMR14203X  [REGULATOR]
S3  SS12SDP2  [Switch]

### Nets
3.3V: C10.2 C13.2 FB1.1 L2.2 R39.2
3.3VA: C14.2 FB1.2
6V: C12.2 REGULATOR.4(SHDN) REGULATOR.5(VIN) S3.2(NO)
GND: C10.1 C12.1 C13.1 C14.1 D12.1(A) P2.2 R38.1 REGULATOR.2(GND)
NetC11_1: C11.1 D12.2(K) L2.1 REGULATOR.6(SW)
NetC11_2: C11.2 REGULATOR.1(CB)
NetP2_1: P2.1 S3.1(COMMON)
NetR38_2: R38.2 R39.1 REGULATOR.3(FB)

### Library data of the parts
C10-C14 = Cap: Capacitor; Published: 8-Jun-2000; LatestRevisionDate: 17-Jul-2002; LatestRevisionNote: Re-released for DXP Platform.; PackageReference: RAD-0.3; Publisher: Altium Limited; PackageDescription: Radial Cap, Thru-Hole; 2 Leads; 0.3 in Pin Spacing
  C10: Value: 47 μF
  C11: Value: 220 nF
  C12: Value: 1 μF
  C13: Value: 1uF
  C14: Value: 100nF
D12 = Diode: Default Diode; Published: 8-Jun-2000; LatestRevisionDate: 17-Jul-2002; LatestRevisionNote: Re-released for DXP Platform.; PackageVersion: Sep-1996; PackageReference: SMC; Publisher: Altium Limited; PackageDescription: DO-214-AB/SMC; 2 C-Bend Leads; Body 7.9 x 5.9 mm, inc. leads (LxW); Code_JEDEC: DO-214-AB; Farnell Reference: 8734275
FB1 = Inductor: Code_IEC: 1005; Published: 8-Jun-2000; LatestRevisionDate: 29-May-2009; LatestRevisionNote: IPC-7351 Footprint Added.; PackageReference: 0402-A; Publisher: Altium Limited; PackageDescription: Chip Inductor; Code_JEITA: 0402
L2 = Inductor: FabricantReference: 744773139; Fabricant: WURTH ELECTRONIK; Published: 8-Jun-2000; LatestRevisionDate: 29-May-2009; LatestRevisionNote: IPC-7351 Footprint Added.; Publisher: Altium Limited; PackageDescription: Chip Inductor; Value: 39uH; Farnell Reference: 2082620
P2 = Header 2H: Header, 2-Pin, Right Angle; LatestRevisionDate: 17-Jul-2002; LatestRevisionNote: Re-released for DXP Platform.; Publisher: Altium Limited
R38 R39 = Res1: Resistor; Published: 8-Jun-2000; LatestRevisionDate: 17-Jul-2002; LatestRevisionNote: Re-released for DXP Platform.; PackageReference: AXIAL-0.3; Publisher: Altium Limited; PackageDescription: Axial Device, Thru-Hole; 2 Leads; 0.3 in Pin Spacing
  R38: Value: 1 KOhm
  R39: Value: 3.32 KOhm
REGULATOR = Regulator: Farnell Reference: 2064680
S3 = SW-SPST: Single-Pole, Single-Throw Switch; Published: 24-Mar-1999; LatestRevisionDate: 17-Jul-2002; LatestRevisionNote: Re-released for DXP Platform.; PackageReference: SPST-2; Publisher: Altium Limited; PackageDescription: Switch; 2 Leads; Farnell Reference: 1524325

## Sheet Programer.SchDoc
size A
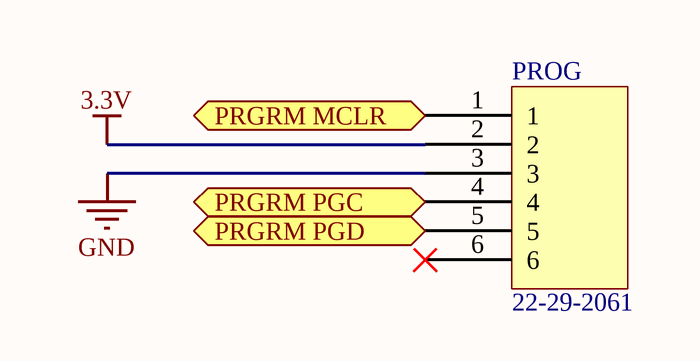
[diagram p13: Programer.SchDoc]

### Parts
PROG  22-29-2061  [HEADER-6-PIN]

### Ports
PRGRM MCLR, PRGRM PGC, PRGRM PGD

### Nets
3.3V: PROG.2
GND: PROG.3
NetC5_1: PROG.1 ; port PRGRM MCLR
NetPIC32Square_15: PROG.4 ; port PRGRM PGC
NetPIC32Square_16: PROG.5 ; port PRGRM PGD

Not connected (* = marked no-connect by the designer): PROG 6*

### Library data of the parts
PROG = HEADER-6-PIN

## Nets that join several sheets
3.3V: PIC32Square (8 pins), Electromagnet (D1.2 L1.1), StartButton (S2.1), LEDmatrix2 (U2.14 U8.14), modeSelection (R21.2), MUX (16 pins), Battery (5 pins), Programer (PROG.2)
3.3VA: PIC32Square (C7.1 PIC32Square.19), Battery (C14.2 FB1.2)
6V: Buzzer (LS1.1), motorController (U6.16), Battery (C12.2 REGULATOR.4 REGULATOR.5 S3.2)
GND: PIC32Square (10 pins), Blueetooth (8 pins), Buzzer (Q10.2), Electromagnet (Q9.2), motorController (8 pins), ProximitySensor (U5.2), StartButton (R22.1), LEDmatrix2 (10 pins), modeSelection (D2.2 D3.2 S1.1), LDR_RGB (R17.2), MUX (17 pins), Battery (8 pins), Programer (PROG.3)
NetC3_2: PIC32Square (PIC32Square.28), Blueetooth (C3.2 U7.23)
NetC5_1: PIC32Square (C5.1 R36.1 R40.2), Programer (PROG.1)
NetP1_1: PIC32Square (PIC32Square.5), LDR_RGB (P1.1)
NetP1_2: PIC32Square (PIC32Square.11), LDR_RGB (P1.2 R17.1)
NetPIC32Square_1: PIC32Square (PIC32Square.1), Electromagnet (Q9.1)
NetPIC32Square_2: PIC32Square (PIC32Square.2), LDR_RGB (R20.1)
NetPIC32Square_3: PIC32Square (PIC32Square.3), LDR_RGB (R19.1)
NetPIC32Square_4: PIC32Square (PIC32Square.4), LDR_RGB (R18.1)
NetPIC32Square_6: PIC32Square (PIC32Square.6), ProximitySensor (U5.3)
NetPIC32Square_12: PIC32Square (PIC32Square.12), ProximitySensor (U5.1)
NetPIC32Square_13: PIC32Square (PIC32Square.13), MUX (U4.1)
NetPIC32Square_15: PIC32Square (PIC32Square.15), Programer (PROG.4)
NetPIC32Square_16: PIC32Square (PIC32Square.16), Programer (PROG.5)
NetPIC32Square_17: PIC32Square (PIC32Square.17), MUX (U4.24)
NetPIC32Square_18: PIC32Square (PIC32Square.18), MUX (U4.13)
NetPIC32Square_21: PIC32Square (PIC32Square.21), MUX (U4.14)
NetPIC32Square_22: PIC32Square (PIC32Square.22), MUX (U4.15)
NetPIC32Square_23: PIC32Square (PIC32Square.23), MUX (U4.11)
NetPIC32Square_24: PIC32Square (PIC32Square.24), MUX (U4.10)
NetPIC32Square_27: PIC32Square (PIC32Square.27), Buzzer (Q10.1)
NetPIC32Square_29: PIC32Square (PIC32Square.29), Blueetooth (U7.15)
NetPIC32Square_30: PIC32Square (PIC32Square.30), Blueetooth (U7.7)
NetPIC32Square_31: PIC32Square (PIC32Square.31), Blueetooth (U7.5)
NetPIC32Square_32: PIC32Square (PIC32Square.32), Blueetooth (U7.6)
NetPIC32Square_33: PIC32Square (PIC32Square.33), modeSelection (R31.1)
NetPIC32Square_34: PIC32Square (PIC32Square.34), modeSelection (R32.1)
NetPIC32Square_35: PIC32Square (PIC32Square.35), modeSelection (R21.1 S1.2)
NetPIC32Square_36: PIC32Square (PIC32Square.36), StartButton (R22.2 S2.2)
NetPIC32Square_49: PIC32Square (PIC32Square.49), motorController (U6.7)
NetPIC32Square_50: PIC32Square (PIC32Square.50), motorController (U6.9)
NetPIC32Square_51: PIC32Square (PIC32Square.51), motorController (U6.2)
NetPIC32Square_52: PIC32Square (PIC32Square.52), motorController (U6.1)
NetPIC32Square_53: PIC32Square (PIC32Square.53), motorController (U6.10)
NetPIC32Square_54: PIC32Square (PIC32Square.54), motorController (U6.15)
NetPIC32Square_55: PIC32Square (PIC32Square.55), LEDmatrix2 (U8.9)
NetPIC32Square_58: PIC32Square (PIC32Square.58), LEDmatrix2 (U8.8)
NetPIC32Square_59: PIC32Square (PIC32Square.59), LEDmatrix2 (U2.2)
NetPIC32Square_60: PIC32Square (PIC32Square.60), LEDmatrix2 (U2.1)
NetPIC32Square_61: PIC32Square (PIC32Square.61), LEDmatrix2 (U8.1)
NetPIC32Square_62: PIC32Square (PIC32Square.62), LEDmatrix2 (U8.2)
NetPIC32Square_63: PIC32Square (PIC32Square.63), LEDmatrix2 (U2.9)
NetPIC32Square_64: PIC32Square (PIC32Square.64), LEDmatrix2 (U2.8)